# Altium project SAMA5D27-SOM1-EK1_ REVD1.PrjPcb (part 3 of 6)

## Sheet 06) JTAG & DBUG.SchDoc
size B; CompanyName: Microchip Technology Inc.; Organization: Microchip Technology; Address1: 2355 West Chandler Blvd.; Address2: Chandler, AZ  85224; Address4: USA; DocumentNumber: 6; SheetNumber: 6; SheetTotal: 9; SheetTitle: **; Time: Time
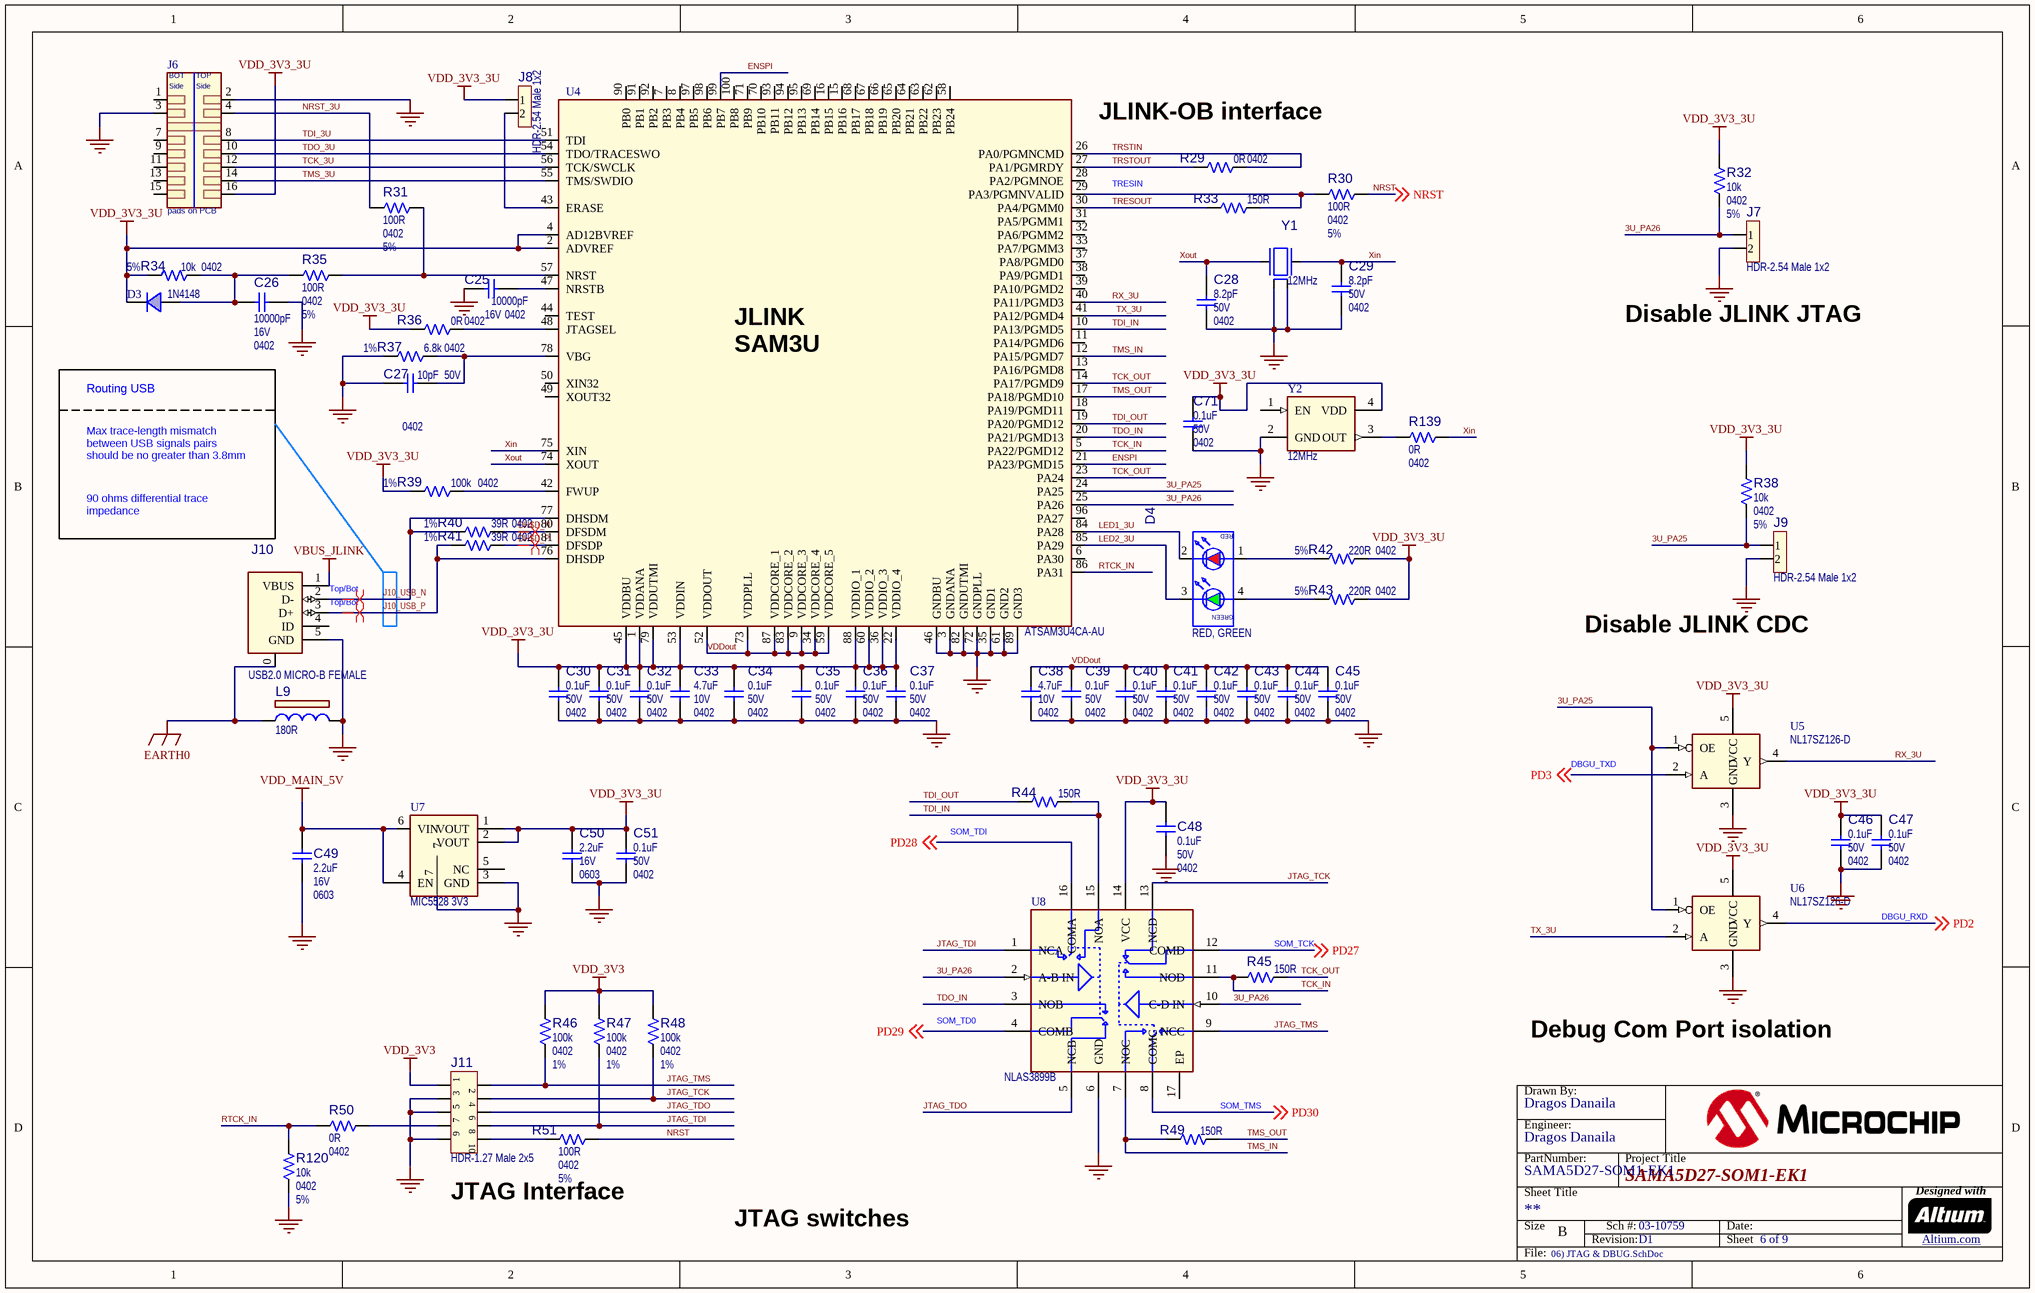
[diagram p5: 06) JTAG & DBUG.SchDoc]

### Parts
(Parts that share a designator on the sheet are numbered #1, #2 ... from top to bottom, then left to right.)
?#6  (no value)  (graphical)
C25  value 10000pF  Voltage: 16V  Package: 0402  [CAP_C_0402]  (hidden comment: Capacitor NP)
C26  value 10000pF  Voltage: 16V  Package: 0402  [CAP_C_0402]  (hidden comment: Capacitor NP)
C27  value 10pF  Voltage: 50V  Package: 0402  [CAP_C_0402]  (hidden comment: Capacitor NP)
C28  value 8.2pF  Voltage: 50V  Package: 0402  [CAP_C_0402]  (hidden comment: Capacitor NP)
C29  value 8.2pF  Voltage: 50V  Package: 0402  [CAP_C_0402]  (hidden comment: Capacitor NP)
C30  value 0.1uF  Voltage: 50V  Package: 0402  [CAP_C_0402]  (hidden comment: Capacitor NP)
C31  value 0.1uF  Voltage: 50V  Package: 0402  [CAP_C_0402]  (hidden comment: Capacitor NP)
C32  value 0.1uF  Voltage: 50V  Package: 0402  [CAP_C_0402]  (hidden comment: Capacitor NP)
C33  value 4.7uF  Voltage: 10V  Package: 0402  [CAP_C_0402]  (hidden comment: Capacitor NP)
C34  value 0.1uF  Voltage: 50V  Package: 0402  [CAP_C_0402]  (hidden comment: Capacitor NP)
C35  value 0.1uF  Voltage: 50V  Package: 0402  [CAP_C_0402]  (hidden comment: Capacitor NP)
C36  value 0.1uF  Voltage: 50V  Package: 0402  [CAP_C_0402]  (hidden comment: Capacitor NP)
C37  value 0.1uF  Voltage: 50V  Package: 0402  [CAP_C_0402]  (hidden comment: Capacitor NP)
C38  value 4.7uF  Voltage: 10V  Package: 0402  [CAP_C_0402]  (hidden comment: Capacitor NP)
C39  value 0.1uF  Voltage: 50V  Package: 0402  [CAP_C_0402]  (hidden comment: Capacitor NP)
C40  value 0.1uF  Voltage: 50V  Package: 0402  [CAP_C_0402]  (hidden comment: Capacitor NP)
C41  value 0.1uF  Voltage: 50V  Package: 0402  [CAP_C_0402]  (hidden comment: Capacitor NP)
C42  value 0.1uF  Voltage: 50V  Package: 0402  [CAP_C_0402]  (hidden comment: Capacitor NP)
C43  value 0.1uF  Voltage: 50V  Package: 0402  [CAP_C_0402]  (hidden comment: Capacitor NP)
C44  value 0.1uF  Voltage: 50V  Package: 0402  [CAP_C_0402]  (hidden comment: Capacitor NP)
C45  value 0.1uF  Voltage: 50V  Package: 0402  [CAP_C_0402]  (hidden comment: Capacitor NP)
C46  value 0.1uF  Voltage: 50V  Package: 0402  [CAP_C_0402]  (hidden comment: Capacitor NP)
C47  value 0.1uF  Voltage: 50V  Package: 0402  [CAP_C_0402]  (hidden comment: Capacitor NP)
C48  value 0.1uF  Voltage: 50V  Package: 0402  [CAP_C_0402]  (hidden comment: Capacitor NP)
C49  value 2.2uF  Voltage: 16V  Package: 0603  [CAP_C_0603]  (hidden comment: Capacitor NP)
C50  value 2.2uF  Voltage: 16V  Package: 0603  [CAP_C_0603]  (hidden comment: Capacitor NP)
C51  value 0.1uF  Voltage: 50V  Package: 0402  [CAP_C_0402]  (hidden comment: Capacitor NP)
C71  value 0.1uF  Voltage: 50V  Package: 0402  [CAP_C_0402]  (hidden comment: Capacitor NP)
D3  value 1N4148  [SOD-323]  (hidden comment: Diode Single)
D4  value RED, GREEN  [LED_DUAL_SMD_2x1.25mm]  (hidden comment: LED DUAL 4 pin)
J6  pads on PCB  [CON_EDGE-CARD_PCB_RA_MEC1-108-02-F-D-RA1-SL]  (no BOM)
J7  value HDR-2.54 Male 1x2  [HDR_M_2.54_1x2]  (hidden comment: Header 1x2)
J8  value HDR-2.54 Male 1x2  [HDR_M_2.54_1x2]  (hidden comment: Header 1x2)
J9  value HDR-2.54 Male 1x2  [HDR_M_2.54_1x2]  (hidden comment: Header 1x2)
J10  value USB2.0 MICRO-B FEMALE  [CON_USB_Micro-AB_SMD_TH_RA_FCI_10118194-0001LF]  (hidden comment: CON USB2.0 Mini_Micro)
J11  value HDR-1.27 Male 2x5  [HDR_M_1.27_2x5_SMD_V_SAM_FTSH-105-01-F-DV-K]  (hidden comment: Header 2x5)
L9  value 180R  [IND_C_0603]  (hidden comment: Ferrite Bead)
R29  value 0R  Package: 0402  [RES_C_0402]  (hidden comment: Resistor)
R30  value 100R  Package: 0402  Tolerance: 5%  [RES_C_0402]  (hidden comment: Resistor)
R31  value 100R  Package: 0402  Tolerance: 5%  [RES_C_0402]  (hidden comment: Resistor)
R32  value 10k  Package: 0402  Tolerance: 5%  [RES_C_0402]  (hidden comment: Resistor)
R33  value 150R  [RES_C_0402]  (hidden comment: Resistor)
R34  value 10k  Package: 0402  Tolerance: 5%  [RES_C_0402]  (hidden comment: Resistor)
R35  value 100R  Package: 0402  Tolerance: 5%  [RES_C_0402]  (hidden comment: Resistor)
R36  value 0R  Package: 0402  [RES_C_0402]  (hidden comment: Resistor)
R37  value 6.8k  Package: 0402  Tolerance: 1%  [RES_C_0402]  (hidden comment: Resistor)
R38  value 10k  Package: 0402  Tolerance: 5%  [RES_C_0402]  (hidden comment: Resistor)
R39  value 100k  Package: 0402  Tolerance: 1%  [RES_C_0402]  (hidden comment: Resistor)
R40  value 39R  Package: 0402  Tolerance: 1%  [RES_C_0402]  (hidden comment: Resistor)
R41  value 39R  Package: 0402  Tolerance: 1%  [RES_C_0402]  (hidden comment: Resistor)
R42  value 220R  Package: 0402  Tolerance: 5%  [RES_C_0402]  (hidden comment: Resistor)
R43  value 220R  Package: 0402  Tolerance: 5%  [RES_C_0402]  (hidden comment: Resistor)
R44  value 150R  [RES_C_0402]  (hidden comment: Resistor)
R45  value 150R  [RES_C_0402]  (hidden comment: Resistor)
R46  value 100k  Package: 0402  Tolerance: 1%  [RES_C_0402]  (hidden comment: Resistor)
R47  value 100k  Package: 0402  Tolerance: 1%  [RES_C_0402]  (hidden comment: Resistor)
R48  value 100k  Package: 0402  Tolerance: 1%  [RES_C_0402]  (hidden comment: Resistor)
R49  value 150R  [RES_C_0402]  (hidden comment: Resistor)
R50  value 0R  Package: 0402  [RES_C_0402]  (hidden comment: Resistor)
R51  value 100R  Package: 0402  Tolerance: 5%  [RES_C_0402]  (hidden comment: Resistor)
R120  value 10k  Package: 0402  Tolerance: 5%  [RES_C_0402]  (hidden comment: Resistor)
R139  value 0R  Package: 0402  [RES_C_0402]  (hidden comment: Resistor)
U4  value ATSAM3U4CA-AU  [LQFP-100_14x14]  (hidden comment: ATSAM3U4CA-AU LQFP-100)
U5  value NL17SZ126-D  [SOT-353]  (hidden comment: NL17SZ126-D SOT-353)
U6  value NL17SZ126-D  [SOT-353]  (hidden comment: NL17SZ126-D SOT-353)
U7  value MIC5528 3V3  [DFN-6_1.2x1.2]  (hidden comment: MIC5528MT DFN-6)
U8  value NLAS3899B  [QFN-16_3X3_EP1.4X1.4]  (hidden comment: NLAS3899B QFN16)
Y1  value 12MHz  [CRYSTAL_L7.5W5.2H1.4]  (hidden comment: Crystal 4 Pins)
Y2  value 12MHz  [OSCILLATOR_ASE]  (hidden comment: OSCILLATOR 4 Pins)

### Nets
EARTH0: J10.0(SHLD) L9.1
GND: C25.1 C26.2 C27.2 C28.2 C29.2 C30.2 C31.2 C32.2 C33.2 C34.2 C35.2 C36.2 C37.2 C38.2 C39.2 C40.2 C41.2 C42.2 C43.2 C44.2 C45.2 C46.2 C47.2 C48.2 C49.2 C50.2 C51.2 C71.2 J6.2 J6.3 J7.2 J9.2 J10.5(GND) J11.3 J11.5 J11.9 L9.2 R37.1 R120.2 U4.3(GNDANA) U4.35(GND1) U4.46(GNDBU) U4.61(GND2) U4.72(GNDPLL) U4.82(GNDUTMI) U4.89(GND3) U5.3(GND) U6.3(GND) U7.3(GND) U7.7 U8.6(GND) Y1.2(GND) Y1.4(GND) Y2.2(GND)  [also labelled GND_POWER]
VBUS_JLINK: J10.1(VBUS)
VDD_3V3: J11.1 R46.1 R47.1 R48.1
VDD_3V3_3U: C30.1 C31.1 C32.1 C33.1 C34.1 C35.1 C36.1 C37.1 C46.1 C47.1 C48.1 C50.1 C51.1 C71.1 D3.2(K) J6.16 J8.1 R32.1 R34.1 R36.1 R38.1 R39.1 R42.2 R43.2 U4.1(VDDANA) U4.2(ADVREF) U4.4(AD12BVREF) U4.22(VDDIO_4) U4.36(VDDIO_3) U4.45(VDDBU) U4.53(VDDIN) U4.60(VDDIO_2) U4.79(VDDUTMI) U4.88(VDDIO_1) U5.5(VCC) U6.5(VCC) U7.1(VOUT) U7.2(VOUT) U8.14(VCC) Y2.4(VDD)
VDD_MAIN_5V: C49.1 U7.4(EN) U7.6(VIN)
3U_PA25: J9.1 R38.2 U4.24(PA25) U5.1(OE) U6.1(OE)
3U_PA26: J7.1 R32.2 U4.25(PA26) U8.2(A-B_IN) U8.10(C-D_IN)
DHSD_N: R40.2 U4.80(DFSDM)
DHSD_P: R41.2 U4.81(DFSDP)
ENSPI: U4.21(PA23/PGMD15) U4.99(PB7)
J10_USB_N: J10.2(D-) R40.1 U4.77(DHSDM)
J10_USB_P: J10.3(D+) R41.1 U4.76(DHSDP)
JTAG_TCK: J11.4 R48.2 U8.13(NCD)
JTAG_TDI: J11.8 R47.2 U8.1(NCA)
JTAG_TDO: J11.6 U8.5(NCB)
JTAG_TMS: J11.2 R46.2 U8.9(NCC)
LED1_3U: D4.2(K1) U4.84(PA28)
LED2_3U: D4.3(K2) U4.85(PA29)
NRST: R30.2 R51.2 ; off-sheet NRST
NRST_3U: J6.4 R31.1
PD2: U6.4(Y) ; off-sheet PD2
PD3: U5.2(A) ; off-sheet PD3
PD27: U8.12(COMD) ; off-sheet PD27
PD28: U8.16(COMA) ; off-sheet PD28
PD29: U8.4(COMB) ; off-sheet PD29
PD30: U8.8(COMC) ; off-sheet PD30
RTCK_IN: R50.1 R120.1 U4.86(PA31)
RX_3U: U4.40(PA11/PGMD3) U5.4(Y)
TCK_3U: J6.12 U4.56(TCK/SWCLK)
TCK_IN: R45.1 U4.5(PA22/PGMD12) U8.11(NOD)
TCK_OUT: R45.2 U4.14(PA17/PGMD9) U4.23(PA24)
TDI_3U: J6.8 U4.51(TDI)
TDI_IN: R44.2 U4.10(PA13/PGMD5) U8.15(NOA)
TDI_OUT: R44.1 U4.19(PA20/PGMD12)
TDO_3U: J6.10 U4.54(TDO/TRACESWO)
TDO_IN: U4.20(PA21/PGMD13) U8.3(NOB)
TMS_3U: J6.14 U4.55(TMS/SWDIO)
TMS_IN: R49.1 U4.12(PA15/PGMD7) U8.7(NOC)
TMS_OUT: R49.2 U4.17(PA18/PGMD10)
TRESOUT: R33.1 U4.30(PA4/PGMM0)
TRSTIN: R29.2 U4.26(PA0/PGMNCMD)
TRSTOUT: R29.1 U4.27(PA1/PGMRDY)
TX_3U: U4.41(PA12/PGMD4) U6.2(A)
VDDout: C38.1 C39.1 C40.1 C41.1 C42.1 C43.1 C44.1 C45.1 U4.9(VDDCORE_3) U4.34(VDDCORE_4) U4.52(VDDOUT) U4.59(VDDCORE_5) U4.73(VDDPLL) U4.83(VDDCORE_2) U4.87(VDDCORE_1)
Xin: C29.1 R139.2 U4.75(XIN) Y1.3(Osc2)
Xout: C28.1 U4.74(XOUT) Y1.1(Osc1)
NetC25_2: C25.2 U4.47(NRSTB)
NetC26_1: C26.1 D3.1(A) R34.2 R35.1
NetC27_1: C27.1 R37.2 U4.78(VBG)
NetD4_1: D4.1(A1) R42.1
NetD4_4: D4.4(A2) R43.1
NetJ8_2: J8.2 U4.43(ERASE)
NetJ11_7: J11.7 R50.2
NetJ11_10: J11.10 R51.1
NetR30_1: R30.1 R33.2 U4.29(PA3/PGMNVALID)
NetR31_2: R31.2 R35.2 U4.57(NRST)
NetR36_2: R36.2 U4.48(JTAGSEL)
NetR39_2: R39.2 U4.42(FWUP)
NetR139_1: R139.1 Y2.3(OUT)

Not connected (* = marked no-connect by the designer): J6 1 7 9 11 13 15; J10 4(ID); U4 6(PA30) 7(PB3) 8(PB4) 11(PA14/PGMD6) 13(PA16/PGMD8) 15(PB16) 16(PB15) 18(PA19/PGMD11) 28(PA2/PGMNOE) 31(PA5/PGMM1) 32(PA6/PGMM2) 33(PA7/PGMM3) 37(PA8/PGMD0) 38(PA9/PGMD1) 39(PA10/PGMD2) 44(TEST) 49(XOUT32) 50(XIN32) 58(PB24) 62(PB23) 63(PB22) 64(PB21) 65(PB20) 66(PB19) 67(PB18) 68(PB17) 69(PB14) 70(PB10) 71(PB9) 90(PB0) 91(PB1) 92(PB2) 93(PB11) 94(PB12) 95(PB13) 96(PA27) 97(PB5) 98(PB6) 100(PB8); U7 5(NC); U8 17(EP); Y2 1(EN)

### Layout directives
differential pair: DHSD_N, DHSD_P, J10_USB_N, J10_USB_P

### Notes on the sheet
- JLINK-OB interface
- (near U4) TRESIN
- Disable JLINK JTAG
- Routing USB
- (near U4) JLINK
  SAM3U
- Max trace-length mismatch
  between USB signals pairs
  should be no greater than 3.8mm
- 90 ohms differential trace
  impedance
- (near J10) Top/Bot
- Disable JLINK CDC
- DBGU_TXD
- SOM_TDI
- (near R45) SOM_TCK
- DBGU_RXD
- SOM_TD0
- Debug Com Port isolation
- SOM_TMS
- JTAG Interface
- JTAG switches
- Drawn By:
- Engineer:
- PartNumber:
- Project Title
- Sheet Title
- Size
- B
- Revision:
- Sch #:
- Date:
- Sheet
- Designed with
- Altium.com <http://go.altium.com/MicrochipLandingPage_Evaluation.html>
- File:
- (in symbol CON1674) BOT; TOP; Side
- (in symbol DIODE1110) RED; GREEN

### Library data of the parts
?#6 = Title Block B
C25 C26 = CAP0278: Capacitor; Manufacturer 1: KEMET; Manufacturer Part Number 1: C0402C103K4RACTU; Description_: CAP CER 10000pF 16V 10% X7R SMD 0402; Dev Tools Status: Production; Tolerance: 10%; Temperature Coeffcient: X7R; Type: Ceramic; Populated: YES; MCHP-ID: CAP0278; Revision: 1; Symbol: Capacitor NP; Status: MCL Design; ComponentLink1URL: https://chn-vm-apps.microchip.com/mchprepo/parts/Datasheets/KEM_C1002_X7R_SMD.pdf; ComponentLink1Description: SVN Datasheet; ComponentLink2URL: C:\ALTIUM_WORK\00001_MCHP-CDB\Datasheets\KEM_C1002_X7R_SMD.pdf; ComponentLink2Description: Local Datasheet; ComponentLink3URL: C:\ALTIUM_WORK\00001_MCHP-CDB\Library\LibraryRefs\Capacitor NP.SchLib; ComponentLink3Description: Open Symbol; ComponentLink4URL: C:\ALTIUM_WORK\00001_MCHP-CDB\Library\Footprints\CAP_C_0402.PcbLib; ComponentLink4Description: Open Footprint; ComponentLink5Description: Open Footprint 2; ComponentLink6Description: Open Footprint 3; ComponentLink7Description: Open Footprint 4; Operating Temperature: -55C to +125C; Category: Capacitor; Supplier 1: Digi-Key; Supplier Part Number 1: 399-1038-1-ND; Quantity Override: 1; Manufacturer 2: KEMET; Manufacturer Part Number 2: C0402C103K4RAC; Supplier 2: KEMET; Supplier Part Number 2: C0402C103K4RAC
C27 = CAP0613: Capacitor; Manufacturer 1: Murata; Manufacturer Part Number 1: GRM1555C1H100JZ01D; Description_: CAP CER 10pF 50V 5% NP0 SMD 0402; Dev Tools Status: Production; Tolerance: 5%; Temperature Coeffcient: NP0; Type: Ceramic; Populated: Yes; MCHP-ID: CAP0613; Revision: 1; Symbol: Capacitor NP; Status: MCL Design; ComponentLink1URL: https://chn-vm-apps.microchip.com/mchprepo/parts/Datasheets/L0005E.pdf; ComponentLink1Description: SVN Datasheet; ComponentLink2URL: C:\ALTIUM_WORK\00001_MCHP-CDB\Datasheets\L0005E.pdf; ComponentLink2Description: Local Datasheet; ComponentLink3URL: C:\ALTIUM_WORK\00001_MCHP-CDB\Library\LibraryRefs\Capacitor NP.SchLib; ComponentLink3Description: Open Symbol; ComponentLink4URL: C:\ALTIUM_WORK\00001_MCHP-CDB\Library\Footprints\CAP_C_0402.PcbLib; ComponentLink4Description: Open Footprint; ComponentLink5Description: Open Footprint 2; ComponentLink6Description: Open Footprint 3; ComponentLink7Description: Open Footprint 4; Operating Temperature: -55C to +125C; Category: Capacitor; Manufacturer 2: Murata; Manufacturer Part Number 2: GJM1555C1H100JB01D; Manufacturer 3: Murata; Manufacturer Part Number 3: GRM1555C1H100JA01D; Supplier 1: Digi-Key; Supplier Part Number 1: 490-1278-1-ND; Supplier 2: Digi-Key; Supplier Part Number 2: 490-3113-2-ND; Supplier 3: Digi-Key; Supplier Part Number 3: 490-5921-2-ND; Quantity Override: 1
C28 C29 = CAP1379: Capacitor; Manufacturer 1: Johanson Technology Inc; Manufacturer Part Number 1: 500R07S8R2CV4T; Description_: CAP HiQ 8.2pF 50V 0.25pF NP0 3.04GHz SMD 0402; Dev Tools Status: Production; Tolerance: 0.25pF; Temperature Coeffcient: NP0; ESR: 0.04R; Type: HiQ; Owner: Gabor Bihari; Populated: DNP; MCHP-ID: CAP1379; Revision: 1; Symbol: Capacitor NP; Status: MCL Design; ComponentLink1URL: https://chn-vm-apps.microchip.com/mchprepo/parts/Datasheets/JTI-CAT-MLCC-HighQ.pdf; ComponentLink1Description: SVN Datasheet; ComponentLink2URL: C:\ALTIUM_WORK\00001_MCHP-CDB\Datasheets\JTI-CAT-MLCC-HighQ.pdf; ComponentLink2Description: Local Datasheet; ComponentLink3URL: C:\ALTIUM_WORK\00001_MCHP-CDB\Library\LibraryRefs\Capacitor NP.SchLib; ComponentLink3Description: Open Symbol; ComponentLink4URL: C:\ALTIUM_WORK\00001_MCHP-CDB\Library\Footprints\CAP_C_0402.PcbLib; ComponentLink4Description: Open Footprint; ComponentLink5Description: Open Footprint 2; ComponentLink6Description: Open Footprint 3; ComponentLink7Description: Open Footprint 4; Operating Temperature: -55C to 125C; Category: Capacitor; Supplier 1: Digikey; Supplier Part Number 1: 712-1293-1-ND; Quantity Override: 1
C30-C32 C34-C37 C39-C48 C51 C71 = CAP1463: Capacitor; Manufacturer 1: TDK Corporation; Manufacturer Part Number 1: C1005X7R1H104K050BB; Description_: CAP CER 0.1uF 50V 10% X7R SMD 0402; Dev Tools Status: Production; Tolerance: 10%; Temperature Coeffcient: X7R; Type: Ceramic; Owner: Jamus Griego; Populated: YES; MCHP-ID: CAP1463; Revision: 1; Symbol: Capacitor NP; Status: MCL Design; ComponentLink1URL: https://chn-vm-apps.microchip.com/mchprepo/parts/Datasheets/TDKMLCCCapRange.pdf; ComponentLink1Description: SVN Datasheet; ComponentLink2URL: C:\ALTIUM_WORK\00001_MCHP-CDB\Datasheets\TDKMLCCCapRange.pdf; ComponentLink2Description: Local Datasheet; ComponentLink3URL: C:\ALTIUM_WORK\00001_MCHP-CDB\Library\LibraryRefs\Capacitor NP.SchLib; ComponentLink3Description: Open Symbol; ComponentLink4URL: C:\ALTIUM_WORK\00001_MCHP-CDB\Library\Footprints\CAP_C_0402.PcbLib; ComponentLink4Description: Open Footprint; ComponentLink5Description: Open Footprint 2; ComponentLink6Description: Open Footprint 3; ComponentLink7Description: Open Footprint 4; Operating Temperature: -55C to +125C; Category: Capacitor; Supplier 1: Digi-Key; Supplier Part Number 1: 445-5932-1-ND; Quantity Override: 1
C33 C38 = CAP1684: Capacitor; Manufacturer 1: TDK Corporation; Manufacturer Part Number 1: C1005X5R1A475K050BC; Description_: CAP CER 4.7uF 10V 10% X5R SMD 0402; Dev Tools Status: Design; Tolerance: 10%; Temperature Coeffcient: X5R; Type: Ceramic; Owner: Jesus Aviles; Populated: YES; MCHP-ID: CAP1684; Revision: B; Symbol: Capacitor NP; Status: MCL Design; ComponentLink1Description: SVN Datasheet; ComponentLink2Description: Local Datasheet; ComponentLink3URL: C:\ALTIUM_WORK\00001_MCHP-CDB\Library\LibraryRefs\Capacitor NP.SchLib; ComponentLink3Description: Open Symbol; ComponentLink4URL: C:\ALTIUM_WORK\00001_MCHP-CDB\Library\Footprints\CAP_C_0402.PcbLib; ComponentLink4Description: Open Footprint; ComponentLink5Description: Open Footprint 2; ComponentLink6Description: Open Footprint 3; ComponentLink7Description: Open Footprint 4; Operating Temperature: -55C to 85C; Category: Capacitor; Supplier 1: Digi-Key; Supplier Part Number 1: 445-13820-1-ND; Quantity Override: 1
C49 C50 = CAP0597: Capacitor; Manufacturer 1: TDK; Manufacturer Part Number 1: C1608X5R1C225K; Description_: CAP CER 2.2uF 16V 10% X5R SMD 0603; Dev Tools Status: Production; Tolerance: 10%; Temperature Coeffcient: X5R; Type: Ceramic; Populated: Yes; MCHP-ID: CAP0597; Revision: 2; Symbol: Capacitor NP; Status: MCL Design; ComponentLink1URL: https://chn-vm-apps.microchip.com/mchprepo/parts/Datasheets/general_B11.pdf; ComponentLink1Description: SVN Datasheet; ComponentLink2URL: C:\ALTIUM_WORK\00001_MCHP-CDB\Datasheets\general_B11.pdf; ComponentLink2Description: Local Datasheet; ComponentLink3URL: C:\ALTIUM_WORK\00001_MCHP-CDB\Library\LibraryRefs\Capacitor NP.SchLib; ComponentLink3Description: Open Symbol; ComponentLink4URL: C:\ALTIUM_WORK\00001_MCHP-CDB\Library\Footprints\CAP_C_0603.PcbLib; ComponentLink4Description: Open Footprint; ComponentLink5Description: Open Footprint 2; ComponentLink6Description: Open Footprint 3; ComponentLink7Description: Open Footprint 4; Operating Temperature: -55C to +85C; Category: Capacitor; Supplier 1: Digi-Key; Supplier Part Number 1: 445-5157-1-ND; Quantity Override: 1
D3 = DIODE0096: DIO RECT 1N4148 855mV 300mA 75V SOD-323; Manufacturer 1: Diodes Incorporated; Manufacturer Part Number 1: 1N4148WS-7-F; Dev Tools Status: Production; Type: Rectifier Single; Power: 200mW; Reverse Current: 50uA; Populated: Yes; MCHP-ID: DIODE0096; Revision: 1; Symbol: Diode Single; Description_: DIO RECT 1N4148 855mV 300mA 75V SOD-323; Status: MCL Design; Package: SOD-323; ComponentLink1URL: https://chn-vm-apps.microchip.com/mchprepo/parts/Datasheets/ds30097.pdf; ComponentLink1Description: SVN Datasheet; ComponentLink2URL: C:\ALTIUM_WORK\00001_MCHP-CDB\Datasheets\ds30097.pdf; ComponentLink2Description: Local Datasheet; ComponentLink3URL: C:\ALTIUM_WORK\00001_MCHP-CDB\Library\LibraryRefs\Diode Single.SchLib; ComponentLink3Description: Open Symbol; ComponentLink4URL: C:\ALTIUM_WORK\00001_MCHP-CDB\Library\Footprints\SOD-323.PcbLib; ComponentLink4Description: Open Footprint; ComponentLink5Description: Open Footprint 2; ComponentLink6Description: Open Footprint 3; ComponentLink7Description: Open Footprint 4; Operating Temperature: -65C to +150C; Category: Diode; Forward Current: 300mA; Reverse Voltage: 75V; Manufacturer 2: Diodes Incorporated; Manufacturer Part Number 2: 1N4148WS-7; Supplier 1: Digi-Key; Supplier Part Number 1: 1N4148WS-FDICT-ND; Supplier 2: Digi-Key; Supplier Part Number 2: 1N4148WSDITR-ND; Quantity Override: 1
D4 = DIODE1110: LED; Manufacturer 1: Kingbright Corp; Manufacturer Part Number 1: APHBM2012SURKCGKC; Description_: DIO LED BI RED, GREEN 1.95V, 2.1V 30mA 0805; Dev Tools Status: Production; Type: LED Bicolor; Forward Current: 30mA; Power: 75mW; Reverse Current: 10uA; Owner: Bogdan P (M91398); Populated: Yes; MCHP-ID: DIODE1110; Revision: 0; Symbol: LED DUAL 4 PIN; Status: MCL Design; Package: 0805; ComponentLink1URL: https://chn-vm-apps.microchip.com/mchprepo/parts/Datasheets/APHBM2012SURKCGKC.pdf; ComponentLink1Description: SVN Datasheet; ComponentLink2URL: C:\ALTIUM_WORK\00001_MCHP-CDB\Datasheets\APHBM2012SURKCGKC.pdf; ComponentLink2Description: Local Datasheet; ComponentLink3URL: C:\ALTIUM_WORK\00001_MCHP-CDB\Library\LibraryRefs\LED DUAL 4 PIN.SchLib; ComponentLink3Description: Open Symbol; ComponentLink4URL: C:\ALTIUM_WORK\00001_MCHP-CDB\Library\Footprints\LED_DUAL_SMD_2x1.25mm.PcbLib; ComponentLink4Description: Open Footprint; ComponentLink5Description: Open Footprint 2; ComponentLink6Description: Open Footprint 3; ComponentLink7Description: Open Footprint 4; Operating Temperature: -40C to +85C; Category: Diode; Supplier 1: Digi-Key; Supplier Part Number 1: 754-1093-1-ND; Quantity Override: 1
J6 = CON1674: CON_PCB_MEC1-108-02-F-D-RA1-SL; Manufacturer 1: Samtec Inc.; Description_: CON EDGE MEC1 1mm 14P Male PCB VERT; Dev Tools Status: Design; Owner: Dragos Danaila; Current: 1.6A; Populated: NO; MCHP-ID: CON1674; Revision: C; Symbol: CON_PCB_MEC1-108-02-F-D-RA1-SL; Status: MCL Design; ComponentLink1URL: https://chn-vm-apps.microchip.com/mchprepo/parts/Datasheets/mec1-1xx-xx-x-d-rax-x-sl-footprint.pdf; ComponentLink1Description: SVN Datasheet; ComponentLink2URL: C:\ALTIUM_WORK\00001_MCHP-CDB\Datasheets\mec1-1xx-xx-x-d-rax-x-sl-footprint.pdf; ComponentLink2Description: Local Datasheet; ComponentLink3URL: C:\ALTIUM_WORK\00001_MCHP-CDB\Library\LibraryRefs\CON_PCB_MEC1-108-02-F-D-RA1-SL.SchLib; ComponentLink3Description: Open Symbol; ComponentLink4URL: C:\ALTIUM_WORK\00001_MCHP-CDB\Library\Footprints\CON_EDGE-CARD_PCB_RA_MEC1-108-02-F-D-RA1-SL.PcbLib; ComponentLink4Description: Open Footprint; ComponentLink5Description: Open Footprint 2; ComponentLink6Description: Open Footprint 3; ComponentLink7Description: Open Footprint 4; Type: Edge Card; Category: Connector; Manufacturer Part Number 1: MEC1-108-02-F-D-RA1-SL; Supplier 1: Digi-Key; Supplier Part Number 1: SAM11473-ND; Quantity Override: 1
J7-J9 = CON1108: Manufacturer 1: FCI; Manufacturer Part Number 1: 77311-118-02LF; Description_: CON HDR-2.54 Male 1x2 Gold 5.84MH TH VERT; Dev Tools Status: Production; Owner: Bogdan P (M91398); Populated: Yes; MCHP-ID: CON1108; Revision: 1; Symbol: Header 1x2; Status: MCL Design; ComponentLink1URL: https://chn-vm-apps.microchip.com/mchprepo/parts/Datasheets/77311.pdf; ComponentLink1Description: SVN Datasheet; ComponentLink2URL: C:\ALTIUM_WORK\00001_MCHP-CDB\Datasheets\77311.pdf; ComponentLink2Description: Local Datasheet; ComponentLink3URL: C:\ALTIUM_WORK\00001_MCHP-CDB\Library\LibraryRefs\Header 1x2.SchLib; ComponentLink3Description: Open Symbol; ComponentLink4URL: C:\ALTIUM_WORK\00001_MCHP-CDB\Library\Footprints\HDR_M_2.54_1x2.PcbLib; ComponentLink4Description: Open Footprint; ComponentLink5Description: Open Footprint 2; ComponentLink6Description: Open Footprint 3; ComponentLink7Description: Open Footprint 4; Type: Header 2.54mm; Category: Connector; Manufacturer 2: FCI; Manufacturer Part Number 2: 68001-202HLF; Manufacturer 3: FCI; Manufacturer Part Number 3: 68000-202HLF; Manufacturer 4: Samtec; Manufacturer Part Number 4: TSW-102-07-G-S; Manufacturer 5: Sullins; Manufacturer Part Number 5: PBC02SAAN; Manufacturer 6: SPC Technology; Manufacturer Part Number 6: SPC20481; Manufacturer 7: Samtec; Manufacturer Part Number 7: TSW-102-07-F-S; Manufacturer 8: Nextron; Manufacturer Part Number 8: R-211-0211-0021-000; Manufacturer 9: Samtec; Manufacturer Part Number 9: TSW-102-07-S-S; Supplier 1: Digi-Key; Supplier Part Number 1: 609-4434-ND; Supplier 2: Digi-Key; Supplier Part Number 2: 609-3469-ND; Supplier 3: Digi-Key; Supplier Part Number 3: 609-3502-ND; Supplier 4: Digi-Key; Supplier Part Number 4: SAM1029-02-ND; Supplier 5: Digi-Key; Supplier Part Number 5: S1011E-02-ND; Supplier 6: Newark; Supplier Part Number 6: 93K5734; Supplier 7: Newark; Supplier Part Number 7: 79P3146; Supplier 8: Raynen; Supplier Part Number 8: R-211-0211-0021-000; Supplier 9: Samtec; Supplier Part Number 9: TSW-102-07-S-S; Quantity Override: 1
J10 = CON1383: Connector USB Mini; Manufacturer 1: FCI; Manufacturer Part Number 1: 10118194-0001LF; Description_: CON USB2.0 MICRO-B FEMALE TH/SMD R/A; Dev Tools Status: Production; Owner: Jamus Griego; Populated: YES; MCHP-ID: CON1383; Revision: 1; Symbol: CON USB2.0 Mini_Micro; Status: MCL Design; ComponentLink1URL: https://chn-vm-apps.microchip.com/mchprepo/parts/Datasheets/10118194.pdf; ComponentLink1Description: SVN Datasheet; ComponentLink2URL: C:\ALTIUM_WORK\00001_MCHP-CDB\Datasheets\10118194.pdf; ComponentLink2Description: Local Datasheet; ComponentLink3URL: C:\ALTIUM_WORK\00001_MCHP-CDB\Library\LibraryRefs\CON USB2.0 Mini_Micro.SchLib; ComponentLink3Description: Open Symbol; ComponentLink4URL: C:\ALTIUM_WORK\00001_MCHP-CDB\Library\Footprints\CON_USB_Micro-AB_SMD_TH_RA_FCI_10118194-0001LF.PcbLib; ComponentLink4Description: Open Footprint; ComponentLink5Description: Open Footprint 2; ComponentLink6Description: Open Footprint 3; ComponentLink7Description: Open Footprint 4; Type: USB; Category: Connector; Manufacturer 2: YangMing; Manufacturer Part Number 2: YM-02-363-N05F; Supplier 1: Digi-Key; Supplier Part Number 1: 609-4618-1-ND; Supplier 2: Raynen; Supplier Part Number 2: YangMing YM-02-363-N05F; Quantity Override: 1
J11 = CON1047: CON HDR-1.27 Male 2x5 Gold 3.05MH SMD VERT; Manufacturer 1: Samtec; Manufacturer Part Number 1: FTSH-105-01-F-DV-K; Dev Tools Status: Production; Owner: Tad Ahlvers; Populated: YES; MCHP-ID: CON1047; Revision: 2; Symbol: Header 2x5; Description_: CON HDR-1.27 Male 2x5 Gold 3.05MH SMD VERT; Status: MCL Design; ComponentLink1URL: https://chn-vm-apps.microchip.com/mchprepo/parts/Datasheets/FTSH-1XX-XX-XXX-DV-XXX-MKT.pdf; ComponentLink1Description: SVN Datasheet; ComponentLink2URL: C:\ALTIUM_WORK\00001_MCHP-CDB\Datasheets\FTSH-1XX-XX-XXX-DV-XXX-MKT.pdf; ComponentLink2Description: Local Datasheet; ComponentLink3URL: C:\ALTIUM_WORK\00001_MCHP-CDB\Library\LibraryRefs\Header 2x5.SchLib; ComponentLink3Description: Open Symbol; ComponentLink4URL: C:\ALTIUM_WORK\00001_MCHP-CDB\Library\Footprints\HDR_M_1.27_2x5_SMD_V_SAM_FTSH-105-01-F-DV-K.PcbLib; ComponentLink4Description: Open Footprint; ComponentLink5Description: Open Footprint 2; ComponentLink6Description: Open Footprint 3; ComponentLink7Description: Open Footprint 4; Type: Header 1.27mm; Category: Connector; Supplier 1: Samtec; Supplier Part Number 1: FTSH-105-01-F-DV-K; Quantity Override: 1
L9 = IND1453: FERRITE 180R 1.5A SMD 0603; Manufacturer 1: Murata Electronics North America; Manufacturer Part Number 1: BLM18PG181SN1D; Dev Tools Status: Design; Owner: Dragos Danaila; DCR: 0.09R; Test Frequency: 100MHz; Populated: YES; MCHP-ID: IND1453; Revision: A; Symbol: Ferrite Bead; Description_: FERRITE 180R 1.5A SMD 0603; Status: MCL Design; ComponentLink1URL: https://chn-vm-apps.microchip.com/mchprepo/parts/Datasheets/ENFA0003.pdf; ComponentLink1Description: SVN Datasheet; ComponentLink2URL: C:\ALTIUM_WORK\00001_MCHP-CDB\Datasheets\ENFA0003.pdf; ComponentLink2Description: Local Datasheet; ComponentLink3URL: C:\ALTIUM_WORK\00001_MCHP-CDB\Library\LibraryRefs\Ferrite Bead.SchLib; ComponentLink3Description: Open Symbol; ComponentLink4URL: C:\ALTIUM_WORK\00001_MCHP-CDB\Library\Footprints\IND_C_0603.PcbLib; ComponentLink4Description: Open Footprint; ComponentLink5Description: Open Footprint 2; ComponentLink6Description: Open Footprint 3; ComponentLink7Description: Open Footprint 4; Operating Temperature: -55C to +125C; Package: 0603; Type: Ferrite Bead; Category: Inductor; Saturation Current: 1.5A; Supplier 1: Digi-Key; Supplier Part Number 1: 490-5263-1-ND; Quantity Override: 1
R29 R139 = RSMT0730: Manufacturer 1: Panasonic; Manufacturer Part Number 1: ERJ-2GE0R00X; Description_: RES TKF 0R SMD 0402; Dev Tools Status: Production; Power: 1/10W; Populated: Yes; MCHP-ID: RSMT0730; Revision: 2; Symbol: Resistor; Status: MCL Design; ComponentLink1URL: https://chn-vm-apps.microchip.com/mchprepo/parts/Datasheets/AOA0000CE1.pdf; ComponentLink1Description: SVN Datasheet; ComponentLink2URL: C:\ALTIUM_WORK\00001_MCHP-CDB\Datasheets\AOA0000CE1.pdf; ComponentLink2Description: Local Datasheet; ComponentLink3URL: C:\ALTIUM_WORK\00001_MCHP-CDB\Library\LibraryRefs\Resistor.SchLib; ComponentLink3Description: Open Symbol; ComponentLink4URL: C:\ALTIUM_WORK\00001_MCHP-CDB\Library\Footprints\RES_C_0402.PcbLib; ComponentLink4Description: Open Footprint; ComponentLink5Description: Open Footprint 2; ComponentLink6Description: Open Footprint 3; ComponentLink7Description: Open Footprint 4; Operating Temperature: -55C to +155C; Category: Resistor; Type: RES SMD; Composition: TKF; Manufacturer 2: Vishay; Manufacturer Part Number 2: CRCW04020000Z0ED; Supplier 1: Digi-Key; Supplier Part Number 1: P0.0JCT-ND; Supplier 2: Digi-Key; Supplier Part Number 2: 541-0.0JTR-ND; Quantity Override: 1
R30 R31 R35 R51 = RSMT1038: Manufacturer 1: Yageo; Manufacturer Part Number 1: RC0402JR-07100RL; Description_: RES TKF 100R 5% 1/16W SMD 0402; Dev Tools Status: Production; Voltage: 50V; Temperature Coeffcient: 100ppm/C; Power: 1/16W; Owner: Sompoch Loboonlert; Populated: Yes; MCHP-ID: RSMT1038; Revision: 2; Symbol: Resistor; Status: MCL Design; ComponentLink1URL: https://chn-vm-apps.microchip.com/mchprepo/parts/Datasheets/PYu-RC0402_51_RoHS_L_6.pdf; ComponentLink1Description: SVN Datasheet; ComponentLink2URL: C:\ALTIUM_WORK\00001_MCHP-CDB\Datasheets\PYu-RC0402_51_RoHS_L_6.pdf; ComponentLink2Description: Local Datasheet; ComponentLink3URL: C:\ALTIUM_WORK\00001_MCHP-CDB\Library\LibraryRefs\Resistor.SchLib; ComponentLink3Description: Open Symbol; ComponentLink4URL: C:\ALTIUM_WORK\00001_MCHP-CDB\Library\Footprints\RES_C_0402.PcbLib; ComponentLink4Description: Open Footprint; ComponentLink5Description: Open Footprint 2; ComponentLink6Description: Open Footprint 3; ComponentLink7Description: Open Footprint 4; Operating Temperature: -55C to +155C; Category: Resistor; Type: RES SMD; Composition: TKF; Supplier 1: Digi-Key; Supplier Part Number 1: 311-100JRCT-ND; Quantity Override: 1
R32 R34 R38 R120 = RSMT0439: Manufacturer 1: Vishay; Manufacturer Part Number 1: CRCW040210K0JNED; Description_: RES TKF 10k 5% 1/16W SMD 0402; Dev Tools Status: Production; Voltage: 50V; Temperature Coeffcient: 100ppm/C; Power: 1/16W; Populated: Yes; MCHP-ID: RSMT0439; Revision: 1; Symbol: Resistor; Status: MCL Design; ComponentLink1URL: https://chn-vm-apps.microchip.com/mchprepo/parts/Datasheets/PYu-RC0402_51_RoHS_L_6.pdf; ComponentLink1Description: SVN Datasheet; ComponentLink2URL: C:\ALTIUM_WORK\00001_MCHP-CDB\Datasheets\PYu-RC0402_51_RoHS_L_6.pdf; ComponentLink2Description: Local Datasheet; ComponentLink3URL: C:\ALTIUM_WORK\00001_MCHP-CDB\Library\LibraryRefs\Resistor.SchLib; ComponentLink3Description: Open Symbol; ComponentLink4URL: C:\ALTIUM_WORK\00001_MCHP-CDB\Library\Footprints\RES_C_0402.PcbLib; ComponentLink4Description: Open Footprint; ComponentLink5Description: Open Footprint 2; ComponentLink6Description: Open Footprint 3; ComponentLink7Description: Open Footprint 4; Operating Temperature: -55C to +155C; Category: Resistor; Type: RES SMD; Composition: TKF; Manufacturer 2: Yageo; Manufacturer Part Number 2: RC0402JR-0710KL; Supplier 1: Digi-Key; Supplier Part Number 1: 541-10KJCT-ND; Supplier 2: Digi-Key; Supplier Part Number 2: 311-10KJRCT-ND; Quantity Override: 1
R33 R44 R45 R49 = RSMT1167: Manufacturer 1: Vishay Dale; Manufacturer Part Number 1: CRCW0402150RFKED; Description_: RES TKF 150R 1% 1/16W MF 0402; Dev Tools Status: Production; Owner: Jamus Griego; Populated: YES; MCHP-ID: RSMT1167; Revision: 1; Symbol: Resistor; Status: MCL Design; ComponentLink1URL: https://chn-vm-apps.microchip.com/mchprepo/parts/Datasheets/dcrcwe3.pdf; ComponentLink1Description: SVN Datasheet; ComponentLink2URL: C:\ALTIUM_WORK\00001_MCHP-CDB\Datasheets\dcrcwe3.pdf; ComponentLink2Description: Local Datasheet; ComponentLink3URL: C:\ALTIUM_WORK\00001_MCHP-CDB\Library\LibraryRefs\Resistor.SchLib; ComponentLink3Description: Open Symbol; ComponentLink4URL: C:\ALTIUM_WORK\00001_MCHP-CDB\Library\Footprints\RES_C_0402.PcbLib; ComponentLink4Description: Open Footprint; ComponentLink5Description: Open Footprint 2; ComponentLink6Description: Open Footprint 3; ComponentLink7Description: Open Footprint 4; Category: Resistor; Type: RES SMD; Supplier 1: Digi-Key; Supplier Part Number 1: 541-150LCT-ND; Quantity Override: 1
R36 R50 = RSMT0730: Manufacturer 1: Panasonic; Manufacturer Part Number 1: ERJ-2GE0R00X; Description_: RES TKF 0R SMD 0402; Dev Tools Status: Production; Power: 1/10W; Populated: DNP; MCHP-ID: RSMT0730; Revision: 2; Symbol: Resistor; Status: MCL Design; ComponentLink1URL: https://chn-vm-apps.microchip.com/mchprepo/parts/Datasheets/AOA0000CE1.pdf; ComponentLink1Description: SVN Datasheet; ComponentLink2URL: C:\ALTIUM_WORK\00001_MCHP-CDB\Datasheets\AOA0000CE1.pdf; ComponentLink2Description: Local Datasheet; ComponentLink3URL: C:\ALTIUM_WORK\00001_MCHP-CDB\Library\LibraryRefs\Resistor.SchLib; ComponentLink3Description: Open Symbol; ComponentLink4URL: C:\ALTIUM_WORK\00001_MCHP-CDB\Library\Footprints\RES_C_0402.PcbLib; ComponentLink4Description: Open Footprint; ComponentLink5Description: Open Footprint 2; ComponentLink6Description: Open Footprint 3; ComponentLink7Description: Open Footprint 4; Operating Temperature: -55C to +155C; Category: Resistor; Type: RES SMD; Composition: TKF; Manufacturer 2: Vishay; Manufacturer Part Number 2: CRCW04020000Z0ED; Supplier 1: Digi-Key; Supplier Part Number 1: P0.0JCT-ND; Supplier 2: Digi-Key; Supplier Part Number 2: 541-0.0JTR-ND; Quantity Override: 1
R37 = RSMT1211: Manufacturer 1: Vishay Dale; Manufacturer Part Number 1: CRCW04026K80FKED; Description_: RES TKF 6.8k 1% 1/16W SMD 0402; Dev Tools Status: Design; Voltage: 50V; Temperature Coeffcient: 100ppm/C; Power: 1/16W; Owner: Dragos Danaila; Populated: YES; MCHP-ID: RSMT1211; Revision: A; Symbol: Resistor; Status: MCL Design; ComponentLink1URL: https://chn-vm-apps.microchip.com/mchprepo/parts/Datasheets/dcrcwe3.pdf; ComponentLink1Description: SVN Datasheet; ComponentLink2URL: C:\ALTIUM_WORK\00001_MCHP-CDB\Datasheets\dcrcwe3.pdf; ComponentLink2Description: Local Datasheet; ComponentLink3URL: C:\ALTIUM_WORK\00001_MCHP-CDB\Library\LibraryRefs\Resistor.SchLib; ComponentLink3Description: Open Symbol; ComponentLink4URL: C:\ALTIUM_WORK\00001_MCHP-CDB\Library\Footprints\RES_C_0402.PcbLib; ComponentLink4Description: Open Footprint; ComponentLink5Description: Open Footprint 2; ComponentLink6Description: Open Footprint 3; ComponentLink7Description: Open Footprint 4; Operating Temperature: -55C to +155C; Category: Resistor; Type: RES SMD; Composition: TKF; Supplier 1: Digi-Key; Supplier Part Number 1: 541-6.80KLCT-ND; Quantity Override: 1
R39 R46-R48 = RES1011: Manufacturer 1: Panasonic; Manufacturer Part Number 1: ERJ-2RKF1003X; Description_: RES TKF 100k 1% 1/10W SMD 0402; Dev Tools Status: Production; Voltage: 50V; Temperature Coeffcient: 100ppm/C; Power: 1/10W; Owner: Tad Ahlvers; Populated: YES; MCHP-ID: RES1011; Revision: 1; Symbol: Resistor; Status: MCL Design; ComponentLink1URL: https://chn-vm-apps.microchip.com/mchprepo/parts/Datasheets/AOA0000CE2.pdf; ComponentLink1Description: SVN Datasheet; ComponentLink2URL: C:\ALTIUM_WORK\00001_MCHP-CDB\Datasheets\AOA0000CE2.pdf; ComponentLink2Description: Local Datasheet; ComponentLink3URL: C:\ALTIUM_WORK\00001_MCHP-CDB\Library\LibraryRefs\Resistor.SchLib; ComponentLink3Description: Open Symbol; ComponentLink4URL: C:\ALTIUM_WORK\00001_MCHP-CDB\Library\Footprints\RES_C_0402.PcbLib; ComponentLink4Description: Open Footprint; ComponentLink5Description: Open Footprint 2; ComponentLink6Description: Open Footprint 3; ComponentLink7Description: Open Footprint 4; Operating Temperature: -55C to +125C; Category: Resistor; Type: RES SMD; Composition: TKF; Supplier 1: Digi-Key; Supplier Part Number 1: P100KLCT-ND; Quantity Override: 1
R40 R41 = RES1800: Manufacturer 1: Yageo; Manufacturer Part Number 1: RC0402FR-0739RL; Description_: RES TKF 39R 1% 1/16W SMD 0402; Dev Tools Status: Design; Circuit Type: Single; Power: 1/16W; Owner: Sompoch Loboonlert; Populated: YES; MCHP-ID: RES1800; Revision: B; Symbol: Resistor; Status: MCL Design; ComponentLink1URL: https://chn-vm-apps.microchip.com/mchprepo/parts/Datasheets/PYu-R_INT-thick_7.pdf; ComponentLink1Description: SVN Datasheet; ComponentLink2URL: C:\ALTIUM_WORK\00001_MCHP-CDB\Datasheets\PYu-R_INT-thick_7.pdf; ComponentLink2Description: Local Datasheet; ComponentLink3URL: C:\ALTIUM_WORK\00001_MCHP-CDB\Library\LibraryRefs\Resistor.SchLib; ComponentLink3Description: Open Symbol; ComponentLink4URL: C:\ALTIUM_WORK\00001_MCHP-CDB\Library\Footprints\RES_C_0402.PcbLib; ComponentLink4Description: Open Footprint; ComponentLink5Description: Open Footprint 2; ComponentLink6Description: Open Footprint 3; ComponentLink7Description: Open Footprint 4; Operating Temperature: -55°C ~ 155°C; Category: Resistor; Type: RES SMD; Composition: TKF; Manufacturer 2: Digi-Key; Manufacturer Part Number 2: 311-39.0LRCT-ND; Supplier 1: Yageo; Supplier Part Number 1: RC0402FR-0739RL; Supplier 2: Digi-Key; Supplier Part Number 2: 311-39.0LRCT-ND; Quantity Override: 1
R42 R43 = RES1008: Manufacturer 1: Panasonic - ECG; Manufacturer Part Number 1: ERJ-2GEJ221X; Description_: RES TKF 220R 5% 1/10W SMD 0402; Dev Tools Status: Production; Voltage: 50V; Temperature Coeffcient: 200ppm/C; Power: 1/10W; Owner: Tad Ahlvers; Populated: YES; MCHP-ID: RES1008; Revision: 0; Symbol: Resistor; Status: MCL Design; ComponentLink1URL: https://chn-vm-apps.microchip.com/mchprepo/parts/Datasheets/AOA0000CE1.pdf; ComponentLink1Description: SVN Datasheet; ComponentLink2URL: C:\ALTIUM_WORK\00001_MCHP-CDB\Datasheets\AOA0000CE1.pdf; ComponentLink2Description: Local Datasheet; ComponentLink3URL: C:\ALTIUM_WORK\00001_MCHP-CDB\Library\LibraryRefs\Resistor.SchLib; ComponentLink3Description: Open Symbol; ComponentLink4URL: C:\ALTIUM_WORK\00001_MCHP-CDB\Library\Footprints\RES_C_0402.PcbLib; ComponentLink4Description: Open Footprint; ComponentLink5Description: Open Footprint 2; ComponentLink6Description: Open Footprint 3; ComponentLink7Description: Open Footprint 4; Operating Temperature: -55C to +155C; Category: Resistor; Type: RES SMD; Composition: TKF; Supplier 1: Digi-Key; Supplier Part Number 1: P220JTR-ND; Quantity Override: 1
U4 = MIC7235: Manufacturer 1: Microchip Technology; Description_: MCHP MCU 32-BIT 96MHz 256kB 56kB ATSAM3U4CA-AU LQFP-100; MAPS Description: LQFP,GREEN,IND TEMP,MRL A; Dev Tools Status: Design; Owner: Alexandru Chiser - M19201; MPC: 58Z247H7XC04; LeadContent: HALOGEN-FREE; TempRange: -40C to +85C; Stage: REL; PackageWidth: 14x14x1.4mm; PackingMedia: TRAY; ForceMinOrderQtyMult: True; MinOrderQty: 90; LeadCount: 100; Program Memory KBytes: 256; Program Memory KWords: 64; Ram: 51200; EEPROM: 0; IOPins: 57; MaxSpeed: 96; OscillatorMHz: 4,8,12Mhz,32Khz; ADC Channels: 8; ADCBit: 12; USART: 4; I2C: 1; Input Capture: 6; CapTouchCH: 28; DigitalTimerQty_16bit: 3; Populated: YES; MCHP-ID: MIC7235; Symbol: ATSAM3U4CA-AU LQFP-100; Type: 32-Bit; Status: MCL Design; Revision: A; Category: MCHP-Microcontroller; ComponentLink1URL: http://www.microchip.com/wwwproducts/Devices.aspx?product=ATSAM3U4C; ComponentLink1Description: SVN Datasheet; ComponentLink2URL: C:\ALTIUM_WORK\00001_MCHP-CDB\Datasheets\atmel-6430-32-bit-cortex-m3-microcontroller-sam3u4-sam3u2-sam3u1_datasheet.pdf; ComponentLink2Description: Local Datasheet; ComponentLink3URL: C:\ALTIUM_WORK\00001_MCHP-CDB\Library\LibraryRefs\ATSAM3U4CA-AU LQFP-100.SchLib; ComponentLink3Description: Open Symbol; ComponentLink4URL: C:\ALTIUM_WORK\00001_MCHP-CDB\Library\Footprints\LQFP-100_14x14.PcbLib; ComponentLink4Description: Open Footprint; ComponentLink5Description: Open Footprint 2; ComponentLink6Description: Open Footprint 3; ComponentLink7Description: Open Footprint 4; Manufacturer Part Number 1: ATSAM3U4CA-AU; Supplier 1: Digi-Key; Supplier Part Number 1: ATSAM3U4CA-AU-ND; IntroductionDate: 2016-12-22; PackageType: LQFP; Family: ATSAM3U; Comparators: 0; DAChannels: 0; SPI: 4; CAN: 0; USBChannels: 1; PWM Channels: 0; mtrlcntrlpwmchannels: 0; SMPS PWM Channels: 0; QEI Channels: 1; SegmentLCD: 0; DigitalTimerQty_8bit: 0; DigitalTimerQty_32bit: 0; Quantity Override: 1
U5 U6 = IC1434: Manufacturer 1: ON Semiconductor; Manufacturer Part Number 1: NL17SZ126DFT2G; MCHP-ID: IC1434; Description_: IC BUFFER NL17SZ126DFT2G TRI-ST NON-INV SOT-353; Dev Tools Status: Design; Vin: -0.5V to +7.0V; Owner: Alexandru Chiser - M19201; Populated: YES; Revision: A; Symbol: NL17SZ126-D SOT-353; Status: MCL Design; Package: SOT-353; ComponentLink1URL: https://chn-vm-apps.microchip.com/mchprepo/parts/Datasheets/NL17SZ126-D.PDF; ComponentLink1Description: SVN Datasheet; ComponentLink2URL: C:\ALTIUM_WORK\00001_MCHP-CDB\Datasheets\NL17SZ126-D.PDF; ComponentLink2Description: Local Datasheet; ComponentLink3URL: C:\ALTIUM_WORK\00001_MCHP-CDB\Library\LibraryRefs\NL17SZ126-D SOT-353.SchLib; ComponentLink3Description: Open Symbol; ComponentLink4URL: C:\ALTIUM_WORK\00001_MCHP-CDB\Library\Footprints\SOT-353.PcbLib; ComponentLink4Description: Open Footprint; ComponentLink5Description: Open Footprint 2; ComponentLink6Description: Open Footprint 3; ComponentLink7Description: Open Footprint 4; Operating Temperature: -40C to +125C; Type: Buffer; Category: IC; Supplier 1: Digi-Key; Supplier Part Number 1: NL17SZ126DFT2GOSCT-ND; Quantity Override: 1
U7 = MIC6905: Manufacturer 1: Microchip Technology; Manufacturer Part Number 1: MIC5528-3.3YMT-TR; Description_: MCHP ANALOG LDO 3.3V MIC5528-3.3YMT-TR 6-TDFN; MAPS Description: Single, 500mA LDO w/ Auto Discharge & Internal Enable Pulldown; Dev Tools Status: Production; Owner: Tim Moffat; MPC: TKFC1YHHAA02; LeadContent: Pb-FREE; PackingMedia: T/R; Stage: REL; LeadCount: 6; PackageWidth: 1.2x1.2x0.6mm; ForceMinOrderQtyMult: True; MinOrderQty: 5000; TempRange: -40C to +125C; tblDeviceFamilyID: 7519; Populated: YES; MCHP-ID: MIC6905; Symbol: MIC5528MT DFN-6; Type: LDO; Status: MCL Design; Revision: 1; Category: MCHP-Analog; ComponentLink1URL: http://www.microchip.com/wwwproducts/Devices.aspx?product=MIC5528; ComponentLink1Description: SVN Datasheet; ComponentLink2URL: C:\ALTIUM_WORK\00001_MCHP-CDB\Datasheets\MIC5528.pdf; ComponentLink2Description: Local Datasheet; ComponentLink3URL: C:\ALTIUM_WORK\00001_MCHP-CDB\Library\LibraryRefs\MIC5528MT DFN-6.SchLib; ComponentLink3Description: Open Symbol; ComponentLink4URL: C:\ALTIUM_WORK\00001_MCHP-CDB\Library\Footprints\DFN-6_1.2x1.2.PcbLib; ComponentLink4Description: Open Footprint; ComponentLink5Description: Open Footprint 2; ComponentLink6Description: Open Footprint 3; ComponentLink7Description: Open Footprint 4; Supplier 1: Digi-Key; Supplier Part Number 1: 576-4766-1-ND; IntroductionDate: 2015-10-18; PackageType: UDFN; Quantity Override: 1
U8 = IC1436: IC SWITCHER NLAS3899B Analog Switch QFN16; Manufacturer 1: ON Semiconductor; Manufacturer Part Number 1: NLAS3899BMNTWG; MCHP-ID: IC1436; Dev Tools Status: Design; Vin: 4.3V; Owner: Dragos Danaila; Populated: YES; Revision: A; Symbol: NLAS3899B QFN16; Description_: IC SWITCHER NLAS3899B Analog Switch QFN16; Status: MCL Design; Package: QFN16; ComponentLink1URL: https://chn-vm-apps.microchip.com/mchprepo/parts/Datasheets/NLAS3899B-D-260431.pdf; ComponentLink1Description: SVN Datasheet; ComponentLink2URL: C:\ALTIUM_WORK\00001_MCHP-CDB\Datasheets\NLAS3899B-D-260431.pdf; ComponentLink2Description: Local Datasheet; ComponentLink3URL: C:\ALTIUM_WORK\00001_MCHP-CDB\Library\LibraryRefs\NLAS3899B QFN16.SchLib; ComponentLink3Description: Open Symbol; ComponentLink4URL: C:\ALTIUM_WORK\00001_MCHP-CDB\Library\Footprints\QFN-16_3X3_EP1.4X1.4.PcbLib; ComponentLink4Description: Open Footprint; ComponentLink5Description: Open Footprint 2; ComponentLink6Description: Open Footprint 3; ComponentLink7Description: Open Footprint 4; Operating Temperature: -65C to +150C; Type: Switcher; Category: IC; Supplier 1: Digi-Key; Supplier Part Number 1: 863-NLAS3899BMNTWG; Quantity Override: 1
Y1 = OSC1155: Crystal; Manufacturer 1: IQD Frequency Products; Manufacturer Part Number 1: LFXTAL026384Reel; Description_: CRYSTAL 12MHz 16pF SMD L7.5W5.0H1.4; Dev Tools Status: Design; Owner: Dragos Danaila; Tolerance: 30ppm; Load Capacitance: 16pF; Populated: DNP; MCHP-ID: OSC1155; Revision: A; Symbol: Crystal 4 Pins; Status: MCL Design; ComponentLink1URL: https://chn-vm-apps.microchip.com/mchprepo/parts/Datasheets/LFXTAL026384Reel-940412.pdf; ComponentLink1Description: SVN Datasheet; ComponentLink2URL: C:\ALTIUM_WORK\00001_MCHP-CDB\Datasheets\LFXTAL026384Reel-940412.pdf; ComponentLink2Description: Local Datasheet; ComponentLink3URL: C:\ALTIUM_WORK\00001_MCHP-CDB\Library\LibraryRefs\Crystal 4 Pins.SchLib; ComponentLink3Description: Open Symbol; ComponentLink4URL: C:\ALTIUM_WORK\00001_MCHP-CDB\Library\Footprints\CRYSTAL_L7.5W5.2H1.4.PcbLib; ComponentLink4Description: Open Footprint; ComponentLink5Description: Open Footprint 2; ComponentLink6Description: Open Footprint 3; ComponentLink7Description: Open Footprint 4; Operating Temperature: -20C to +70C; Package: 7.5mm X 5mm; Type: Crystal; Category: Crystal/Oscillator; Voltage: -; Supply Current: -; Supplier 1: Mouser; Supplier Part Number 1: 449-LFXTAL026384REEL; Quantity Override: 1
Y2 = OSC1154: OSCILLATOR 12MHz 3.3V SMD ASE; Manufacturer 1: Abracon LLC; Manufacturer Part Number 1: ASE-12.000MHZ-LC-T; Dev Tools Status: Design; Owner: Dragos Danaila; Tolerance: 50ppm; Supply Current: 7mA; Populated: YES; MCHP-ID: OSC1154; Revision: A; Symbol: OSCILLATOR 4 Pins; Description_: OSCILLATOR 12MHz 3.3V SMD ASE; Status: MCL Design; ComponentLink1URL: https://chn-vm-apps.microchip.com/mchprepo/parts/Datasheets/ABM8G.pdf; ComponentLink1Description: SVN Datasheet; ComponentLink2URL: C:\ALTIUM_WORK\00001_MCHP-CDB\Datasheets\ABM8G.pdf; ComponentLink2Description: Local Datasheet; ComponentLink3URL: C:\ALTIUM_WORK\00001_MCHP-CDB\Library\LibraryRefs\OSCILLATOR 4 Pins.SchLib; ComponentLink3Description: Open Symbol; ComponentLink4URL: C:\ALTIUM_WORK\00001_MCHP-CDB\Library\Footprints\OSCILLATOR_ASE.PcbLib; ComponentLink4Description: Open Footprint; ComponentLink5Description: Open Footprint 2; ComponentLink6Description: Open Footprint 3; ComponentLink7Description: Open Footprint 4; Operating Temperature: -55C to +125C; Package: ASE; Type: Oscillator; Category: Crystal/Oscillator; Voltage: 3.3V; Supplier 1: Digi-Key; Supplier Part Number 1: 535-9561-1-ND; Quantity Override: 1